# Altium schematic sheet DC_DC_CONTROL.SchDoc
size A4; SheetNumber: 2; SheetTotal: 2
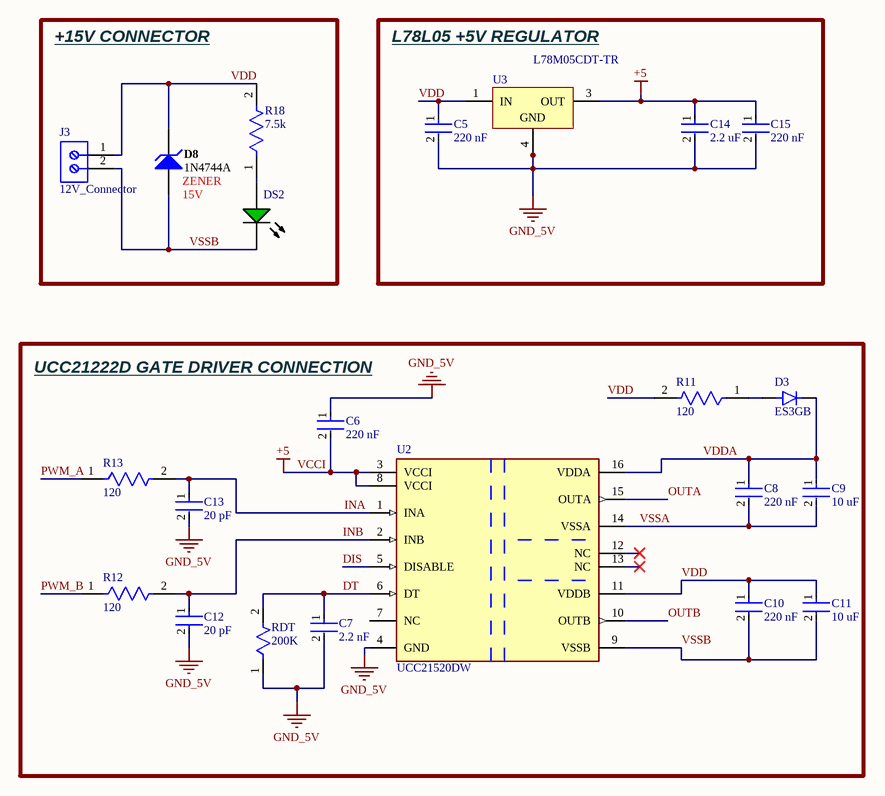
[diagram p0: DC_DC_CONTROL.SchDoc]

## Parts
C5  220 nF  [FP-C0805C-DN-MFG]
C6  220 nF  [FP-C0805C-DN-MFG]
C7  2.2 nF  [FP-C0805C-DN-MFG]
C8  220 nF  [FP-C0805C-DN-MFG]
C9  10 uF  [FP-C0805C-DN-MFG]
C10  220 nF  [FP-C0805C-DN-MFG]
C11  10 uF  [FP-C0805C-DN-MFG]
C12  20 pF  [FP-C0805C-DN-MFG]
C13  20 pF  [FP-C0805C-DN-MFG]
C14  2.2 uF  [FP-C0805C-DN-MFG]
C15  220 nF  [FP-C0805C-DN-MFG]
D3  ES3GB  [DIOM4336X265N]
D8  1N4744A  [FAIR-DO-41-2_V]
DS2  HSMG-C170  [AVAG-HSMX-C170_V]  (value not drawn)
J3  12V_Connector  [691214110002]
R11  120  [FP-RC0805-0_6-IPC_C]
R12  120  [FP-RC0805-0_6-IPC_C]
R13  120  [FP-RC0805-0_6-IPC_C]
R18  7.5k  [FP-RC0805-0_6-IPC_C]
RDT  200K  [PCBComponent_1]
U2  UCC21520DW  [FP-DW0016B-MFG]
U3  L78M05CDT-TR  [TO-252_L]

## Blocks framed on the sheet
+15V CONNECTOR: D8 DS2 J3 R18
L78L05 +5V REGULATOR: C5 C14 C15 U3
UCC21222D GATE DRIVER CONNECTION: C6-C13 D3 R11-R13 RDT U2

## Nets
GND_5V: C5.2 C6.1 C7.2 C12.2 C13.2 C14.2 C15.2 RDT.1 U2.4(GND) U3.4(GND)
VCCI: C6.2 C14.1 C15.1 U2.3(VCCI) U2.8(VCCI) U3.3(OUT)  [also labelled +5]
DIS: U2.5(DISABLE)
DT: C7.1 RDT.2 U2.6(DT)
INA: C13.1 R13.2 U2.1(INA)
INB: C12.1 R12.2 U2.2(INB)
OUTA: U2.15(OUTA)
OUTB: U2.10(OUTB)
PWM_A: R13.1
PWM_B: R12.1
VDD: C5.1 C10.1 C11.1 D8.2(K) J3.1 R11.2 R18.2 U2.11(VDDB) U3.1(IN)
VDDA: C8.1 C9.1 D3.C(K) U2.16(VDDA)
VSSA: C8.2 C9.2 U2.14(VSSA)
VSSB: C10.2 C11.2 D8.1(A) DS2.2(K) J3.2 U2.9(VSSB)
NetD3_A: D3.A R11.1
NetDS2_1: DS2.1(A) R18.1

Not connected (* = marked no-connect by the designer): U2 7(NC) 12(NC)* 13(NC)*

## Notes on the sheet
- (near D8) ZENER
- (near D8) 15V

## Library data of the parts
C5-C15 = CMP-1036-04552-2: CAP CER 0.22UF 50V X7R 0805; Manufacturer: KEMET; Manufacturer Part Number: C0805C224K5RACTU; Value: 0.22 μF; Temperature Coefficient: 30ppm/°C; Material: Ceramic; Tolerance: 0.1; ComponentLink2URL: https://content.kemet.com/datasheets/KEM_C1003_C0G_SMD.pdf; Temperature Characteristic: X7R; Device Class L3: Ceramic Capacitors; Lead Free: Yes; Temperature: -55°C to +125°C; RoHS: TRUE; Capacitance: 0.22 μF; Automotive: No; Octopart: https://octopart.com/c0805c224k5ractu-kemet-144670; Temperature Range Low: -55°C; Height: 0.88mm; Device Class L1: Passive Components; Digikey Description: CAP CER 0.22UF 50V X7R 0805; ComponentLink2Description: Datasheet; Mouser Description: CAP CER 0.22UF 50V X7R 0805; Category: Cap; Ipc Land Pattern Name: CAPC200125X78; Temperature Range High: +125°C; Package: C0805C-DN; Device Class L2: Capacitors; Voltage Rating: 50 V
D3 = ES3GB: MF: {'manufacturer': u'Taiwan Semiconductor'}; Package: None; Price: None; Value: *; MP: ES3GB; Availability: Unavailable
D8 = CMP-0892-00005-1: Zener Diode, 15V, 1W, 5%, -65 to 200 degC, 2-Pin DO-41, Body 2.72 x 5.2 mm, RoHS; Manufacturer: Fairchild Semiconductor; Test Current IZ (mA): 17; PD (W): 1; IR (uA): 5; VZ (Min.) (V): 14.25; VZ (Max.) (V): 15.75; ZZ (Max) (ohm): 10; PackageReference: DO-41-2; ComponentLink1URL: http://www.fairchildsemi.com/; ComponentLink2URL: http://www.fairchildsemi.com/ds/1N/1N4744A.pdf; ComponentLink3Description: Package Specification; PackageDescription: 2-Pin Axial leaded, Body 2.72 x 5.2 mm, Lead Spread 25.4 mm; ComponentLink2Description: Datasheet; PackageVersion: Rev. 2; ComponentLink3URL: http://www.fairchildsemi.com/dwg/DO/DO41A.pdf; Operating and Storage Temperature Range: -65 to 200 degC; PartNumber: 1N4744A; ComponentLink1Description: Manufacturer URL; DatasheetVersion: Rev. H3; RoHS: TRUE; Tolerance: 5%; Mounting Technology: Through Hole
DS2 = CMP-2000-05062-1: Chip LED, Green, 2.2 V, -40 to 85 degC, 2-Pin SMD, Pb-Free, Tape and Reel; Manufacturer: Avago; No. of Pins: 2; Peak Wavelength: 570nm; SVHC: NoSVHC(16-Jun-2014); Dominant Wavelength: 572nm; Forward Current If: 20mA; Viewing Angle: 170deg; Lens Shape: Rectangular; PIV Max: 5V; External Width: 1.25mm; LED Type: Standard; External Depth: 0.8mm; Opto Mounting Orientation: Top; Luminous Intensity: 15mcd; Luminous Intensity Min: 4mcd; Forward Voltage VF Max: 2.6V; External Length / Height: 2mm; Bulb Size: 1.25mmx1.4mm; Light Area Height: 1mm; Voltage Vf Typ: 2.2V; Operating Temperature Max: 85degC; Datasheet Version: Oct-08; MSL: MSL2A-4weeks; Peak Forward Current: 20mA; Package Description: 2-Pin Surface Mount Device, Body 2 x 1.25 mm, Height 0.8 mm; Datasheet URL: https://datasheet.ciiva.com/29280/180495-da-01-en-chip-led-hsmg-c170-gelb-gruen-29280971.pdf; Storage Temperature Min: -40degC; LED Colour: Green; Wavelength Typ: 570nm; Mounting Type: SMD; Forward Current If Max: 20mA; Dominant Wavelength Typ: 572nm; LED Mounting: SMD; Operating Temperature Range: -30degCto+85degC; Operating Temperature Min: -30degC; Manufacturer URL: http://www.avagotech.com/; Packaging: CutTape; Luminous Intensity Typ: 15mcd; Package Reference: HSMX-C170; Storage Temperature Max: 85degC; Opto Case Style: SMD; Forward Voltage: 2.2V
J3 = CMP-1502-02464-2: NexarPartId: 18818288; Plating: Brass, Steel; Current: 10A; Pitch: 3.5052mm; Number of Levels: 1; Number of Contacts: 2; Wire Gauge (Min): 16AWG; Voltage: 300V; Wire Gauge (Max): 24AWG; Stripping Length: -6mm; Number of Pins: 2; Number of Rows: 1; REACH SVHC: Unknown; RoHS: Compliant; Housing Material: Nylon; Termination: Screw; Mount: Through Hole; Contact Plating: Brass, Tin; Number of Positions Per Level: 2; Color: Blue, Green; Width: 7.9mm; Voltage Rating: 300V; Length: 7.4mm; Current Rating: 10A; Wire/Cable Gauge: 24AWG; Packaging: Box; Max Operating Temperature: 105°C; Lead Pitch: 3.5mm; Height: 8.7mm; Contact Material: Brass; Min Operating Temperature: -40°C
R11-R13 = CMP-2100-03668-5: 120  1/8W   0805; Power Rating: 125mW; Temperature Coefficient: 100ppm/°C; Tolerance: 1%; Voltage Rating (DC): 150V; Resistance: 100kR; Package Quantity: 1; Case/Package: 0805; Lead Pitch: 0.4mm; Case Code (Imperial): 0805; Construction: Rectangular; Number of Terminations: 2; RoHS Compliant: Yes; Max Power Dissipation: 125mW; Max Operating Temperature: 155°C; Resistance Tolerance: 1%; Lead Free: Lead Free; Packaging: Tape and Reel; Resistor Type: Thick Film; Min Operating Temperature: -55°C; Case Code (Metric): 2012; Series: RC; Technology: THICK FILM; Voltage Rating: 150V; Termination: SMD/SMT; Width: 0.049inch; Number of Pins: 2; Features: Moisture Resistant; Military Standard: Not; Length: 0.079inch; Depth: 1.25mm; Size Code: 0805; Height: 0.024inch
R18 = CMP-2100-03668-5: 7.5K  1/8W   0805; Power Rating: 125mW; Temperature Coefficient: 100ppm/°C; Tolerance: 1%; Voltage Rating (DC): 150V; Resistance: 100kR; Package Quantity: 1; Case/Package: 0805; Lead Pitch: 0.4mm; Case Code (Imperial): 0805; Construction: Rectangular; Number of Terminations: 2; RoHS Compliant: Yes; Max Power Dissipation: 125mW; Max Operating Temperature: 155°C; Resistance Tolerance: 1%; Lead Free: Lead Free; Packaging: Tape and Reel; Resistor Type: Thick Film; Min Operating Temperature: -55°C; Case Code (Metric): 2012; Series: RC; Technology: THICK FILM; Voltage Rating: 150V; Termination: SMD/SMT; Width: 0.049inch; Number of Pins: 2; Features: Moisture Resistant; Military Standard: Not; Length: 0.079inch; Depth: 1.25mm; Size Code: 0805; Height: 0.024inch
RDT = RES
U2 = CMP-04912-000047-1: DGTL ISO 5.7KV GATE DRVR 16SOIC; Number of Channels: 2; Max Output Current: 6A; Min Supply Voltage: 6.5V; Working Voltage: 2.121kV; Max Supply Voltage: 25V; Max Operating Temperature: 125°C; REACH SVHC: No SVHC; Case/Package: SOIC; Min Operating Temperature: -40°C; Number of Pins: 16; Lead Free: Lead Free
U3 = CMP-0244-00178-1: Positive Voltage Regulator, 5V, 3-Pin DPAK, Tape and Reel; PackageReference: TO-252; ComponentLink1URL: http://www.st.com; ComponentLink2Description: Datasheet; PackageDescription: 3-Pin Transistor Outline Package 2.28 mm Pitch, 9.7 mm Lead Span (DPAK); ComponentLink1Description: Manufacturer URL; DatasheetVersion: 1/11/2010; ComponentLink2URL: http://www.st.com/internet/com/TECHNICAL_RESOURCES/TECHNICAL_LITERATURE/DATASHEET/CD00000447.pdf; PackageVersion: 2011